# EAGLE design breakout (EAGLE 8.7.0)
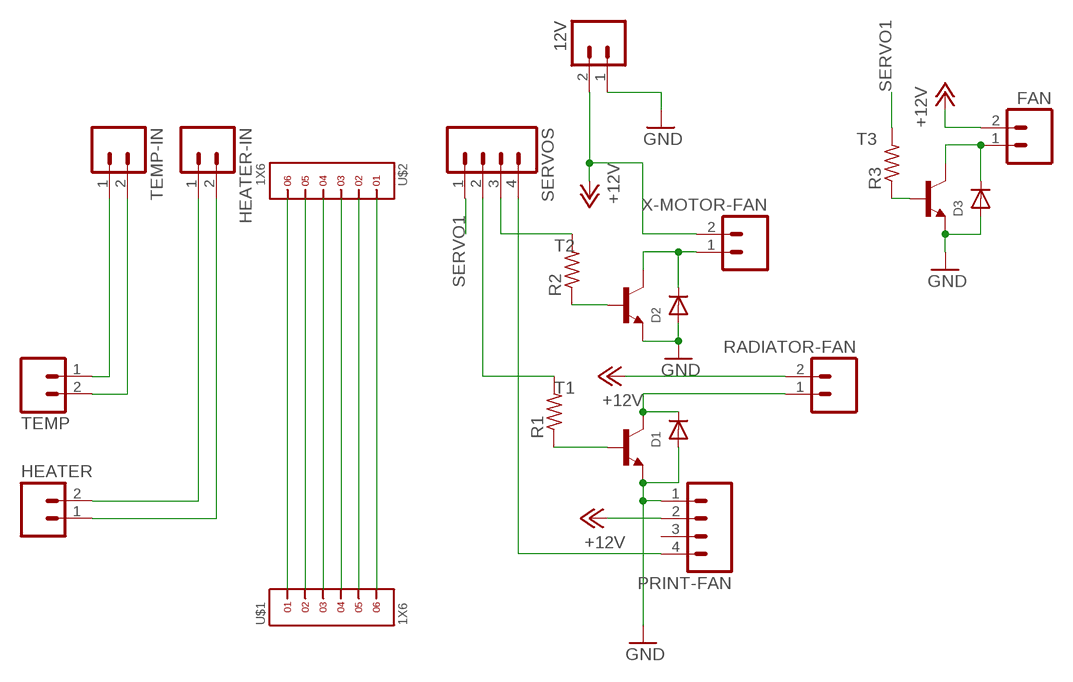
[diagram p0: schematic, sheet 1]

## Parts
12V  M02  [02P]
D1  DIODESMA  [SMADIODE]
D2  DIODESMA  [SMADIODE]
D3  DIODESMA  [SMADIODE]
FAN  M02  [02P]
HEATER  M02  [02P]
HEATER-IN  M02  [02P]
PRINT-FAN  M04  [04P]
R1  R-US_R0603  [R0603]
R2  R-US_R0603  [R0603]
R3  R-US_R0603  [R0603]
RADIATOR-FAN  M02  [02P]
SERVOS  M04  [04P]
T1  BC808-NPN-SOT23-BEC  [SOT23-BEC]
T2  BC808-NPN-SOT23-BEC  [SOT23-BEC]
T3  BC808-NPN-SOT23-BEC  [SOT23-BEC]
TEMP  M02  [02P]
TEMP-IN  M02  [02P]
U$1  1X6  [1X6]
U$2  1X6  [1X6]
X-MOTOR-FAN  M02  [02P]

## Nets
+12V: 12V.2 FAN.2 PRINT-FAN.2 RADIATOR-FAN.2 X-MOTOR-FAN.2
GND: 12V.1 D1.A D2.A D3.A PRINT-FAN.1 T1.E T2.E T3.E
N$1: U$1.1 U$2.6
N$2: U$1.2 U$2.5
N$3: U$1.3 U$2.4
N$4: U$1.4 U$2.3
N$5: U$1.5 U$2.2
N$6: U$1.6 U$2.1
N$7: PRINT-FAN.4 SERVOS.4
N$8: TEMP-IN.1 TEMP.1
N$9: TEMP-IN.2 TEMP.2
N$10: HEATER-IN.1 HEATER.2
N$11: HEATER-IN.2 HEATER.1
N$12: D1.C RADIATOR-FAN.1 T1.C
N$13: D3.C FAN.1 T3.C
N$14: R1.1 T1.B
N$15: R1.2 SERVOS.2
N$16: D2.C T2.C X-MOTOR-FAN.1
N$17: R3.1 T3.B
N$18: R2.1 T2.B
N$19: R2.2 SERVOS.3
SERVO1: R3.2 SERVOS.1
Unconnected: PRINT-FAN.3

## Library data of the parts
12V FAN HEATER HEATER-IN RADIATOR-FAN TEMP TEMP-IN X-MOTOR-FAN = con-amp-quick:M02: AMP QUICK CONNECTOR; OC_FARNELL: unknown; OC_NEWARK: unknown
D1-D3 = adafruit:DIODE: Diode SMADIODE - SMA Surface Mount Package 20V 1A Schottky Diode Digikey: 641-1014-6-ND DO-1N4148 - Through Hole Small Current Diode SOD-123 20V 1 A (.5mV Vf) Schottky Diode - Digikey: MBRX120TPMSCT-ND SOD-323 10V 570mA (.38mV Vf, 3ns) Schottky Diode - Digikey: ZLLS410CT-ND SOD-523 30V 30mA Schottky Diode (RB751S-40TE61) - Digikey: RB751S-40TE61CT-ND SOT23-R/W - SOT23 Package (R = Solder Paste/Reflow Ovens, W = Hand-Soldering) BAT54Film 40V 300mA - Digikey: 497-7162-1-ND
PRINT-FAN SERVOS = con-amp-quick:M04: AMP QUICK CONNECTOR; OC_FARNELL: unknown; OC_NEWARK: unknown
R1-R3 = adafruit:R-US_: RESISTOR, American symbol
T1-T3 = transistor:*-NPN-: NPN Transistror BF959 corrected 2008.03.06
U$1 U$2 = headers(2mm):1X6

## Board
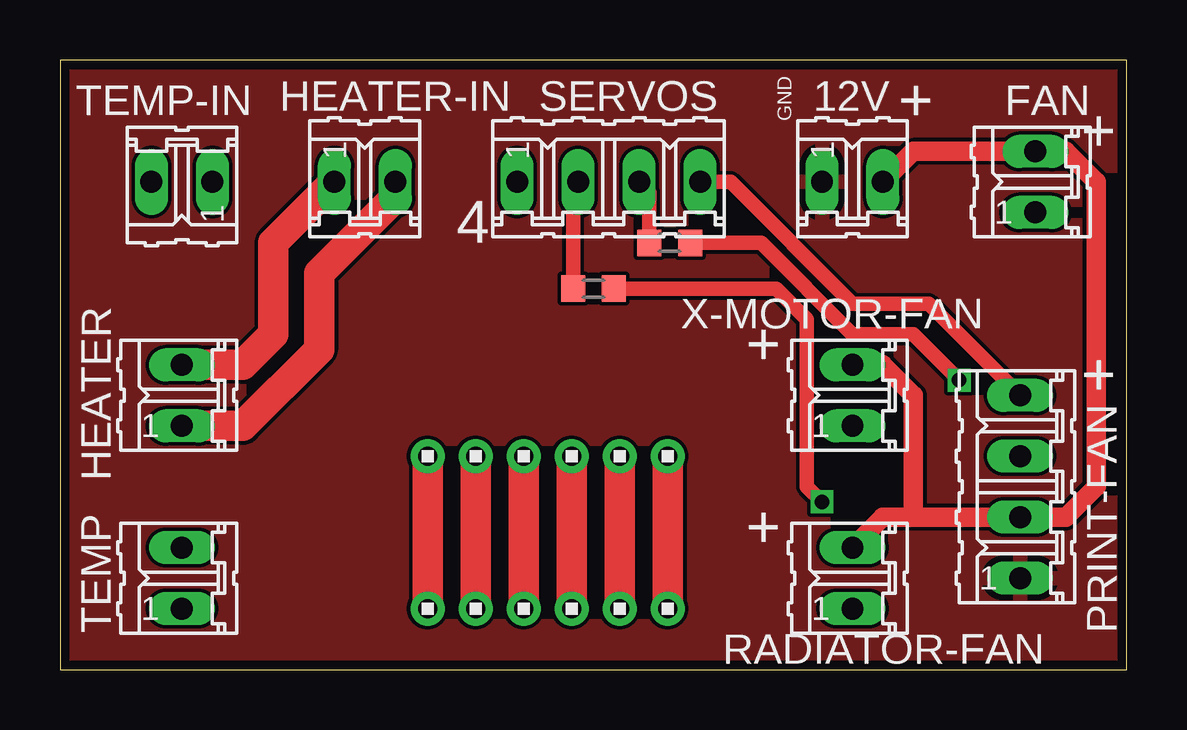
[diagram p1: board, top side]
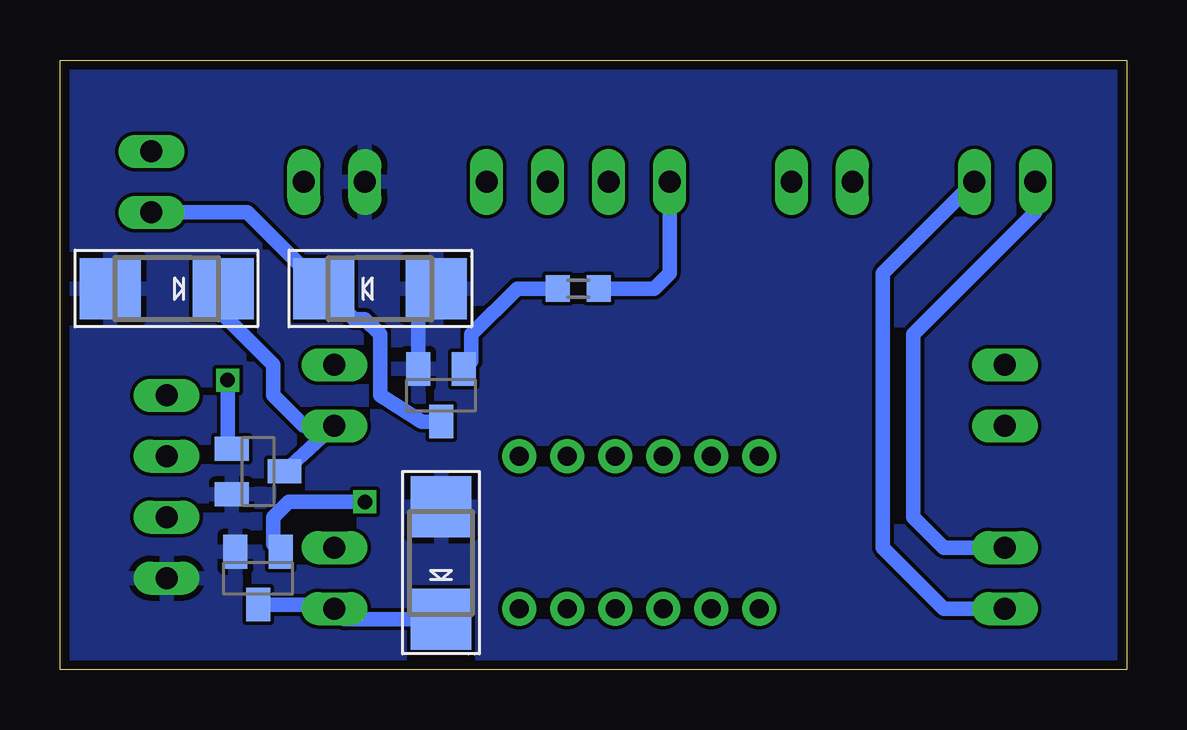
[diagram p2: board, bottom side, seen from below]

Size 44.45 x 25.4 mm. Coordinates in mm from the lower left corner, seen from the top.
Outline: 0,0 44.45,0 44.45,25.4 0,25.4 0,0
Copper layers (1*16): Top 0.0356mm / dielectric 1.5011mm / Bottom 0.0356mm
Design rules "LaenPCBOrder": minimum track width 6mil, minimum drill 13mil, track to track 6mil, track to pad 6mil, pad to pad 6mil, via to via 6mil, smd to smd 6mil, copper to edge 15mil, drill to drill 6mil, minimum pad ring 7mil, minimum via ring 7mil, stop-mask expansion 4mil, vias tented up to drill 0mil, thermal gap 10mil

### Footprints (pad centres in the part's own frame; a part is rotated, then mirrored left to right if it is on the bottom)
02P = drill 0.914 long: 1 -1.27,0; 2 1.27,0
SMADIODE = smd 2.54 x 2.54: A 2.349,0; C -2.349,0
04P = drill 0.914 long: 1 -3.81,0; 2 -1.27,0; 3 1.27,0; 4 3.81,0
R0603 = smd 1 x 1.1: 1 -0.85,0; 2 0.85,0
SOT23-BEC = smd 1 x 1.4: B -0.95,-1.1; C 0,1.1; E 0.95,-1.1
1X6 = drill 0.8 pad 1.422: 1 -5,0; 2 -3,0; 3 -1,0; 4 1,0; 5 3,0; 6 5,0

### Placement (x,y rotation side)
12V  33.02,20.32 0 top
D1  28.58,4.45 90 bottom
D2  40.01,15.88 180 bottom
D3  31.12,15.88 0 bottom
FAN  40.64,20.32 90 top
HEATER  5.08,11.43 90 top
HEATER-IN  12.7,20.32 0 top
PRINT-FAN  40.01,7.62 90 top
R1  22.23,15.88 180 top
R2  25.4,17.78 180 top
R3  22.86,15.88 0 bottom
RADIATOR-FAN  33.02,3.81 90 top
SERVOS  22.86,20.32 0 top
T1  36.2,3.81 180 bottom
T2  36.2,8.26 270 bottom
T3  28.58,11.43 180 bottom
TEMP  5.08,3.81 90 top
TEMP-IN  5.08,20.32 180 top
U$1  20.32,2.54 0 top
U$2  20.32,8.89 180 top
X-MOTOR-FAN  33.02,11.43 90 top

### Tracks (layer width: path | path; a pad name or v marks a point on that pad's centre or on a via)
+12V
  Top 0.813: 35.56,6.35 PRINT-FAN.2 41.91,6.35 43.18,7.62 43.18,20.32 41.91,21.59 FAN.2 35.56,21.59 12V.2 | 35.56,6.35 34.29,6.35 RADIATOR-FAN.2 | X-MOTOR-FAN.2 34.29,12.7 35.56,11.43 35.56,6.35
GND
  Bottom 0.61: T3.E 29.52,15.12 D3.A
  pour Bottom: 0,25.4 44.45,25.4 44.45,0 0,0
  pour Top: 0,25.4 44.45,25.4 44.45,0 0,0
N$1
  Top 1.27: U$2.6 U$1.1
N$2
  Top 1.27: U$2.5 U$1.2
N$3
  Top 1.27: U$2.4 U$1.3
N$4
  Top 1.27: U$2.3 U$1.4
N$5
  Top 1.27: U$2.2 U$1.5
N$6
  Top 1.27: U$2.1 U$1.6
N$7
  Top 0.61: SERVOS.4 27.94,20.32 33.02,15.24 36.2,15.24 PRINT-FAN.4
N$8
  Bottom 0.61: TEMP-IN.1 10.16,16.51 10.16,5.08 7.62,2.54 TEMP.1
N$9
  Bottom 0.61: TEMP-IN.2 3.81,19.05 8.89,13.97 8.89,6.35 7.62,5.08 TEMP.2
N$10
  Top 1.27: HEATER-IN.1 8.89,17.78 8.89,13.97 7.62,12.7 HEATER.2
N$11
  Top 1.27: HEATER-IN.2 13.97,19.68 10.79,16.51 10.79,13.34 7.62,10.16 HEATER.1
N$12
  Bottom 0.61: D1.C 32.58,2.1 RADIATOR-FAN.1 33.19,2.71 T1.C
N$13
  Bottom 0.61: T3.C 29.38,10.33 31.12,11.43 31.12,13.97 31.75,14.61 32.2,14.61 D3.C | 34.29,16.7 D3.C | D3.C 36.64,19.05 FAN.1
N$14  (via drill 0.6)
  Top 0.61: R1.1 29.84,15.88 31.12,14.61 31.12,7.62 v31.75,6.99
  Bottom 0.61: v31.75,6.99 34.93,6.99 35.56,6.35 35.56,5.22 T1.B
N$15
  Top 0.61: R1.2 21.38,20.11 SERVOS.2
N$16
  Bottom 0.61: T2.C X-MOTOR-FAN.1 34.29,10.16 35.56,11.43 35.56,12.7 37.66,14.8 D2.C
N$17
  Bottom 0.61: R3.1 25.4,15.88 27.3,13.97 27.3,12.85 T3.B
N$18  (via drill 0.6)
  Top 0.61: R2.1 29.21,17.78 33.02,13.97 35.56,13.97 v37.47,12.06
  Bottom 0.61: v37.47,12.06 37.47,9.38 T2.B
N$19
  Top 0.61: R2.2 24.55,19.9 SERVOS.3
SERVO1
  Bottom 0.61: SERVOS.1 19.05,16.51 19.69,15.88 R3.2

### Text on the board
tNames: GND | + | + | 4 | + | + | +